# Altium schematic sheet schematic.SchDoc
size A4
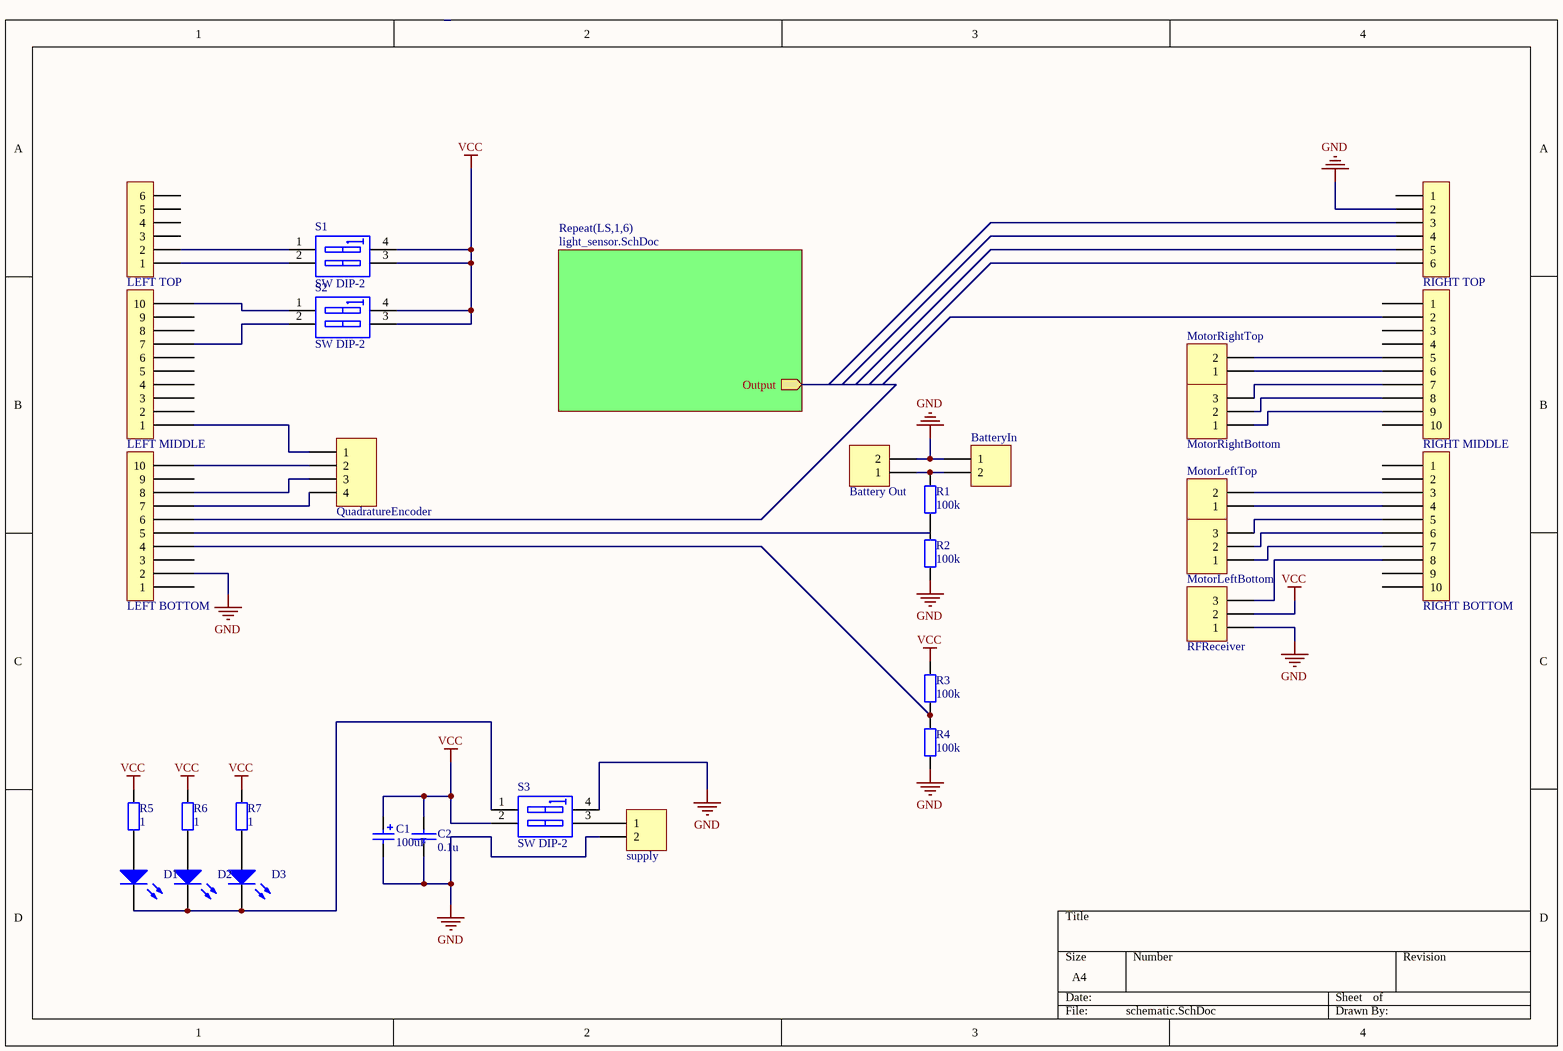
[diagram p0: schematic.SchDoc]

## Parts
Battery_Out  2 Way  [ECE-600102STTH]  (value not drawn)
BatteryIn  2 Way  [ECE-600102STTH]  (value not drawn)
C1  100uF  [ECE-CAPAE4X5.4SM]
C2  0.1u  [ECE-CAPR0.2x0.1TH]
D1  LTST-C170KAKT  [ECE-LED2012-0805SM]  (value not drawn)
D2  LTST-C170KAKT  [ECE-LED2012-0805SM]  (value not drawn)
D3  LTST-C170KAKT  [ECE-LED2012-0805SM]  (value not drawn)
LEFT_BOTTOM  10 Way  [ECE-600110STTH]  (value not drawn)
LEFT_MIDDLE  10 Way  [ECE-600110STTH]  (value not drawn)
LEFT_TOP  6 Way  [ECE-600106STTH]  (value not drawn)
MotorLeftBottom  3 Way  [ECE-600103STTH]  (value not drawn)
MotorLeftTop  2 Way  [ECE-600102STTH]  (value not drawn)
MotorRightBottom  3 Way  [ECE-600103STTH]  (value not drawn)
MotorRightTop  2 Way  [ECE-600102STTH]  (value not drawn)
QuadratureEncoder  4 Way  [ECE-600104STTH]  (value not drawn)
R1  100k  [ECE-RESA0.4TH]
R2  100k  [ECE-RESA0.4TH]
R3  100k  [ECE-RESA0.4TH]
R4  100k  [ECE-RESA0.4TH]
R5  1  [ECE-RESA0.4TH]
R6  1  [ECE-RESA0.4TH]
R7  1  [ECE-RESA0.4TH]
RFReceiver  3 Way  [ECE-600103STTH]  (value not drawn)
RIGHT_BOTTOM  10 Way  [ECE-600110STTH]  (value not drawn)
RIGHT_MIDDLE  10 Way  [ECE-600110STTH]  (value not drawn)
RIGHT_TOP  6 Way  [ECE-600106STTH]  (value not drawn)
S1  SW DIP-2  [DIP-4]
S2  SW DIP-2  [DIP-4]
S3  SW DIP-2  [DIP-4]
supply  2 Way  [ECE-600102STTH]  (value not drawn)

## Sub-sheets
Repeat(LS,1,6) = light_sensor.SchDoc: Output (out)

## Nets
GND: Battery_Out.2 BatteryIn.1 C1.2 C2.2 LEFT_BOTTOM.2 R2.1 R4.1 RFReceiver.1 RIGHT_TOP.2 S3.4(B1) supply.2
VCC: C1.1 C2.1 R3.2 R5.2 R6.2 R7.2 RFReceiver.2 S1.3(B2) S1.4(B1) S2.3(B2) S2.4(B1) S3.2(A2)
NetBattery_Out_1: Battery_Out.1 BatteryIn.2 R1.2
NetD1_1: D1.1(A) R5.1
NetD1_2: D1.2(K) D2.2(K) D3.2(K) S3.1(A1)
NetD2_1: D2.1(A) R6.1
NetD3_1: D3.1(A) R7.1
NetLEFT_BOTTOM_4: LEFT_BOTTOM.4 R3.1 R4.2
NetLEFT_BOTTOM_7: LEFT_BOTTOM.7 QuadratureEncoder.4
NetLEFT_BOTTOM_8: LEFT_BOTTOM.8 QuadratureEncoder.3
NetLEFT_BOTTOM_10: LEFT_BOTTOM.10 QuadratureEncoder.2
NetLEFT_MIDDLE_1: LEFT_MIDDLE.1 QuadratureEncoder.1
NetLEFT_MIDDLE_7: LEFT_MIDDLE.7 S2.2(A2)
NetLEFT_MIDDLE_10: LEFT_MIDDLE.10 S2.1(A1)
NetLEFT_TOP_1: LEFT_TOP.1 S1.2(A2)
NetLEFT_TOP_2: LEFT_TOP.2 S1.1(A1)
NetMotorLeftBottom_1: MotorLeftBottom.1 RIGHT_BOTTOM.7
NetMotorLeftBottom_2: MotorLeftBottom.2 RIGHT_BOTTOM.6
NetMotorLeftBottom_3: MotorLeftBottom.3 RIGHT_BOTTOM.5
NetMotorLeftTop_1: MotorLeftTop.1 RIGHT_BOTTOM.4
NetMotorLeftTop_2: MotorLeftTop.2 RIGHT_BOTTOM.3
NetMotorRightBottom_1: MotorRightBottom.1 RIGHT_MIDDLE.9
NetMotorRightBottom_2: MotorRightBottom.2 RIGHT_MIDDLE.8
NetMotorRightBottom_3: MotorRightBottom.3 RIGHT_MIDDLE.7
NetMotorRightTop_1: MotorRightTop.1 RIGHT_MIDDLE.6
NetMotorRightTop_2: MotorRightTop.2 RIGHT_MIDDLE.5
NetR1_1: R1.1 R2.2
NetRFReceiver_3: RFReceiver.3 RIGHT_BOTTOM.8
NetS3_3: S3.3(B2) supply.1

Not connected (* = marked no-connect by the designer): LEFT_BOTTOM 1 3 5 6 9; LEFT_MIDDLE 2 3 4 5 6 8 9; LEFT_TOP 3 4 5 6; RIGHT_BOTTOM 1 2 9 10; RIGHT_MIDDLE 1 2 3 4 10; RIGHT_TOP 1 3 4 5 6

## Library data of the parts
Battery_Out BatteryIn MotorLeftTop MotorRightTop supply = CON000001: HEADER POLARISED 2WAY TH; Manufactuer: GTK; Manufacturer-PN: 600102ST; Assembly Method: Through hole; Item Type: Item; Path: ece/ts/Lists/Stock Inventory; UoA Stock#: CON000001; Value: 2 Way; Size/Package: 2.54 Radial; Datasheet Link: http://share.engineering.auckland.ac.nz/ece/ts/Student%20Documents/polarised_connectors.pdf; Supplier1: Elecon; Supplier1-PN: YY3N02; Supplier2: Active Components; Supplier2-PN: 600102ST; Component Type: NA; Category: Connector; Status: Active
C1 = CAP000301: CAP 1uF 50V ELE SM; Manufactuer: Nichicon; Manufacturer-PN: UWX1H010MCL1GB; Assembly Method: Surface Mount; Item Type: Item; Path: ece/ts/Lists/Stock Inventory; Revision: July-2002: Re-released for DXP Platform.; Value: 1uF; UoA Stock#: CAP000301; Size/Package: 4 X 5.4; Voltage/Current: 50V; Datasheet Link: http://share.engineering.auckland.ac.nz/ece/ts/Student%20Documents/SMT-Ecaps-e-wx.pdf; Supplier1: Digikey; Supplier1-PN: 493-2130-2-ND; Component Type: CAP-4X5.4-1uF-50V; Category: Capacitor; Status: Active
C2 = CAP000001: CAP CER 10pF 50V TH; Manufactuer: TDK; Manufacturer-PN: FK28C0G1H100D; Assembly Method: Through hole; Item Type: Item; Path: ece/ts/Lists/Stock Inventory; Value: 10pF; UoA Stock#: CAP000001; Size/Package: Radial; Voltage/Current: 50V; Datasheet Link: http://share.engineering.auckland.ac.nz/ece/ts/Student%20Documents/CER%20CAP.pdf; Supplier1: Electus; Supplier1-PN: RC5312; Component Type: NA; Category: Capacitor; Review-date: 41972; Status: Active
D1-D3 = DIO000105: LED RED ORANGE CLEAR 0805 SMD; Manufactuer: Lite-On Inc; Assembly Method: Surface Mount; Voltage/Current: 20mA; Item Type: Item; Path: ece/ts/Lists/Stock Inventory; UoA Stock#: DIO000105; Value: LTST-C170KAKT; Size/Package: 0805 (2012 Metric); Manufacturer-PN: LTST-C170KAKT; Datasheet Link: http://share.engineering.auckland.ac.nz/ece/ts/Student%20Documents/LED-S_110_LTST-C170KAKT.pdf; Supplier1: Digikey; Supplier1-PN: 160-1412-6-ND; Component Type: LED-0805-RED; Category: Diode; Status: Active
LEFT_BOTTOM LEFT_MIDDLE RIGHT_BOTTOM RIGHT_MIDDLE = CON000006: HEADER POLARISED 10WAY TH; Manufactuer: GTK; Manufacturer-PN: 600110ST; Assembly Method: Through hole; Item Type: Item; Path: ece/ts/Lists/Stock Inventory; UoA Stock#: CON000006; Value: 10 Way; Size/Package: 2.54 Radial; Datasheet Link: http://share.engineering.auckland.ac.nz/ece/ts/Student%20Documents/polarised_connectors.pdf; Supplier1: Elecon; Supplier1-PN: YY3N10; Supplier2: Active Components; Supplier2-PN: 600110ST; Component Type: NA; Category: Connector; Status: Active
LEFT_TOP RIGHT_TOP = CON000004: HEADER POLARISED 6WAY TH; Manufactuer: GTK; Manufacturer-PN: 600106ST; Assembly Method: Through hole; Item Type: Item; Path: ece/ts/Lists/Stock Inventory; UoA Stock#: CON000004; Value: 6 Way; Size/Package: 2.54 Radial; Datasheet Link: http://share.engineering.auckland.ac.nz/ece/ts/Student%20Documents/polarised_connectors.pdf; Supplier1: Elecon; Supplier1-PN: YY3N06; Supplier2: Active Components; Supplier2-PN: 600106ST; Component Type: NA; Category: Connector; Status: Active
MotorLeftBottom MotorRightBottom RFReceiver = CON000002: HEADER POLARISED 3WAY TH; Manufactuer: GTK; Manufacturer-PN: 600103ST; Assembly Method: Through hole; Item Type: Item; Path: ece/ts/Lists/Stock Inventory; UoA Stock#: CON000002; Value: 3 Way; Size/Package: 2.54 Radial; Datasheet Link: http://share.engineering.auckland.ac.nz/ece/ts/Student%20Documents/polarised_connectors.pdf; Supplier1: Elecon; Supplier1-PN: YY3N03; Supplier2: Active Components; Supplier2-PN: 600103ST; Component Type: NA; Category: Connector; Status: Active
QuadratureEncoder = CON000003: HEADER POLARISED 4WAY TH; Manufactuer: GTK; Manufacturer-PN: 600104ST; Assembly Method: Through hole; Item Type: Item; Path: ece/ts/Lists/Stock Inventory; UoA Stock#: CON000003; Value: 4 Way; Size/Package: 2.54 Radial; Datasheet Link: http://share.engineering.auckland.ac.nz/ece/ts/Student%20Documents/polarised_connectors.pdf; Supplier1: Elecon; Supplier1-PN: YY3N04; Supplier2: Active Components; Supplier2-PN: 600104ST; Component Type: NA; Category: Connector; Status: Active
R1-R4 = RES000001: RES MF 1R TH; Value: 1; Assembly Method: Through hole; Voltage/Current: 0.6W; Item Type: Item; Path: ece/ts/Lists/Stock Inventory; UoA Stock#: RES000001; Size/Package: Axial 10mm; Supplier1: Element14; Supplier1-PN: 335216; Component Type: NA; Category: Resistor; Status: Active
R5-R7 = RES000001: RES MF 1R TH; Assembly Method: Through hole; Voltage/Current: 0.6W; Item Type: Item; Path: ece/ts/Lists/Stock Inventory; Value: 1; UoA Stock#: RES000001; Size/Package: Axial 10mm; Supplier1: Element14; Supplier1-PN: 335216; Component Type: NA; Category: Resistor; Status: Active
S1-S3 = SW DIP-2: DIP Switch, 2 Position, SPST; Published: 24-Mar-1999; LatestRevisionDate: 17-Jul-2002; LatestRevisionNote: Re-released for DXP Platform.; PackageReference: DIP-4; Publisher: Altium Limited